# EAGLE design BeamMini (EAGLE 7.5.0)
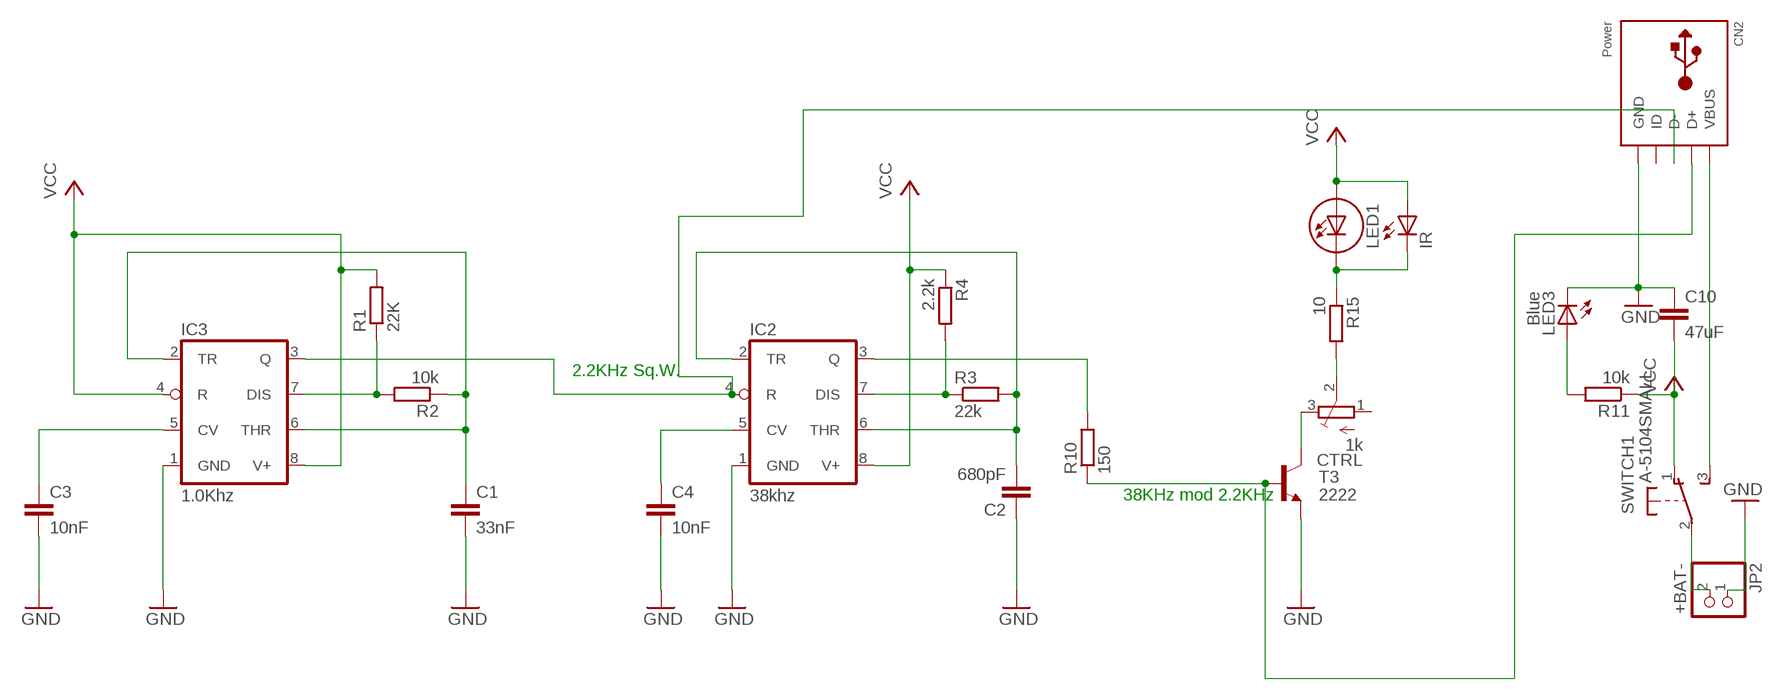
[diagram p0: schematic, sheet 1]

## Parts
C1  33nF  C-EUC0805  [C0805]
C2  680pF  C-EUC0805  [C0805]
C3  10nF  C-EUC0805  [C0805]
C4  10nF  C-EUC0805  [C0805]
C10  47uF  C-EUC0805  [C0805]
CN2  Power  USBMINIB  [USB-MINIB]
CTRL  1k  TRIMPOTTC33X  [TC33X]
IC2  38khz  NE555D  [SO08]
IC3  1.0Khz  NE555D  [SO08]
IR  LED5MM  [LED5MM]
JP2  +BAT-  PINHD-1X02_2.00  [1X02M]
LED1  LUXEON-2  [LUXEON-2]
LED3  Blue  LEDCHIP-LED0805  [CHIP-LED0805]
R1  22K  R-EU_M0805  [M0805]
R2  10k  R-EU_M0805  [M0805]
R3  22k  R-EU_M0805  [M0805]
R4  2.2k  R-EU_M0805  [M0805]
R10  150  R-EU_M0805  [M0805]
R11  10k  R-EU_M0805  [M0805]
R15  10  R-EU_R0805  [R0805]
SWITCH  A-5104SMALL  [A-5104-SMALL]
T3  2222  TRANSISTOR_NPNSOT23  [SOT23]

## Nets
CTRL: CTRL.2(S) R15.2
GND: C1.2 C2.1 C3.2 C4.2 C10.1 CN2.GND IC2.1(GND) IC3.1(GND) JP2.1 LED3.C T3.2(E)
N$1: IC3.7(DIS) R1.1 R2.2
N$2: C3.1 IC3.5(CV)
N$3: C2.2 IC2.2(TR) IC2.6(THR) R3.2
N$4: IC2.7(DIS) R3.1 R4.2
N$5: CN2.D- IC2.4(R) IC3.3(Q)
N$6: C4.1 IC2.5(CV)
N$7: IC2.3(Q) R10.2
N$8: JP2.2 SWITCH.2(1:P)
N$9: C1.1 IC3.2(TR) IC3.6(THR) R2.1
N$10: CN2.D+ R10.1 T3.1(B)
N$11: IR.K(C) LED1.C R15.1
N$12: CTRL.3(E) T3.3(C)
N$16: LED3.A R11.2
N$18: CN2.VBUS SWITCH.3(1:S)
VCC: C10.2 IC2.8(V+) IC3.4(R) IC3.8(V+) IR.A LED1.A R1.2 R4.1 R11.1 SWITCH.1(1:O)
Unconnected: CN2.ID CTRL.1(A) SWITCH.MT1(MT) SWITCH.MT2(MT)

## Notes on the sheet
- 2.2KHz Sq.W.
- 38KHz mod 2.2KHz

## Library data of the parts
C1-C4 C10 = rcl:C-EU: CAPACITOR, European symbol
CN2 = adafruit:USB: USB Connectors USBMINIB - Surface Mount Female Mini-B USB Connector 4UConnector: 06564 By microbuilder.eu Thru-hole RA Female Mini-B USB Connector 4UConnector: 18732 By ladyada.net
CTRL = MyLib:TRIMPOT: SMT trimmer potentiometer part number TC33X http://www.ladyada.net/library/eagle
IC2 IC3 = adafruit:*555: TIMER Changed DIP package to have round (not oval) pin pads http://www.ladyada.net/library/pcb/eaglelibrary.html
IR LED3 = adafruit:LED: LED OSRAM: - CHIPLED LG R971, LG N971, LY N971, LG Q971, LY Q971, LO R971, LY R971 LH N974, LH R974 LS Q976, LO Q976, LY Q976 LO Q996 - Hyper CHIPLED LW Q18S LB Q993, LB Q99A, LB R99A - SideLED LS A670, LO A670, LY A670, LG A670, LP A670 LB A673, LV A673, LT A673, LW A673 LH A674 LY A675 LS A676, LA A676, LO A676, LY A676, LW A676 LS A679, LY A679, LG A679 - Hyper Micro SIDELED® LS Y876, LA Y876, LO Y876, LY Y876 LT Y87S - SmartLED LW L88C, LW L88S LB L89C, LB L89S, LG L890 LS L89K, LO L89K, LY L89K LS L896, LA L896, LO L896, LY L896 - TOPLED LS T670, LO T670, LY T670, LG T670, LP T670 LSG T670, LSP T670, LSY T670, LOP T670, LYG T670 LG T671, LOG T671, LSG T671 LB T673, LV T673, LT T673, LW T673 LH T674 LS T676, LA T676, LO T676, LY T676, LB T676, LH T676, LSB T676, LW T676 LB T67C, LV T67C, LT T67C, LS T67K, LO T67K, LY T67K, LW E67C LS E67B, LA E67B, LO E67B, LY E67B, LB E67C, LV E67C, LT E67C LW T67C LS T679, LY T679, LG T679 LS T770, LO T770, LY T770, LG T770, LP T770 LB T773, LV T773, LT T773, LW T773 LH T774 LS E675, LA E675, LY E675, LS T675 LS T776, LA T776, LO T776, LY T776, LB T776 LHGB T686 LT T68C, LB T68C - Hyper Mini TOPLED® LB M676 - Mini TOPLED Santana® LG M470 LS M47K, LO M47K, LY M47K Source: http://www.osram.convergy.de/
JP2 = pinhead-2:PINHD-1X02: PIN HEADER
LED1 = MyLib:LUXEON-2
R1-R4 R10 R11 R15 = rcl:R-EU_: RESISTOR, European symbol
SWITCH = MyLib:A-5104: E-Switch right-angle slide SPDT Ebay and taydaElectronics A-5014
T3 = SparkFun:TRANSISTOR_NPN: Transistor NPN BJT configuration in SOT23 package. MMBT2222 is the common NPN we use. Double check BCE configuration again layout.

## Net classes
0 default: width 0.203 mm
1 supply: width 0.254 mm

## Board
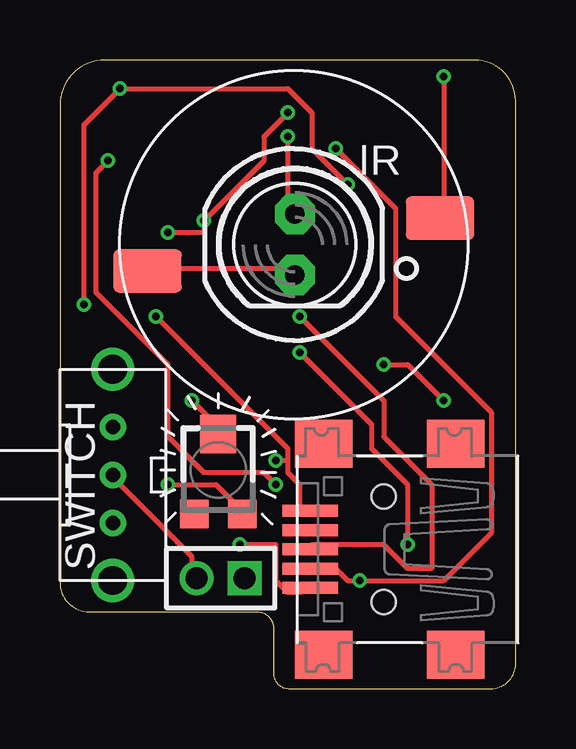
[diagram p1: board, top side]
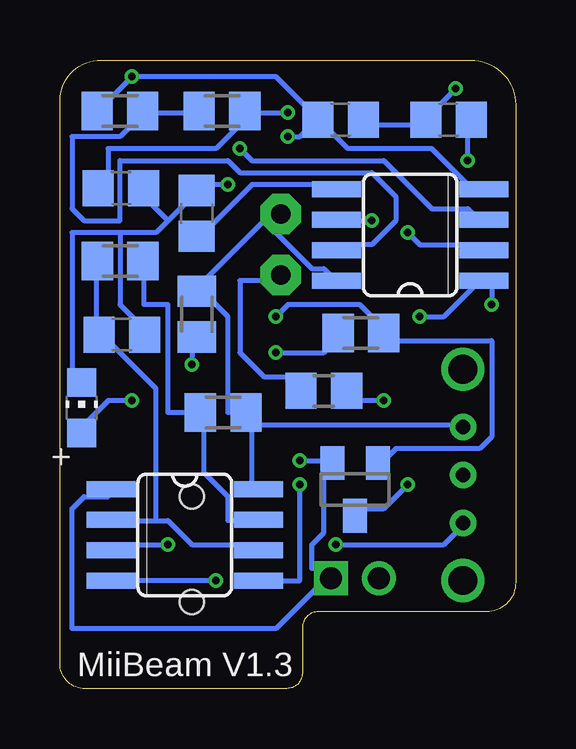
[diagram p2: board, bottom side, seen from below]

Size 19 x 26.19 mm. Coordinates in mm from the lower left corner, seen from the top.
Outline: 19,1.14 19,24.49 arc90 17.3,26.19 1.88,26.19 arc90 0,24.32 0,4.42 arc90 1.22,3.2 8.23,3.2 arc-90 8.9,2.53 8.9,0.64 arc90 9.54,0 18.06,0 arc90 19,1.14
Copper layers (1*16): Top 0.035mm / dielectric 1.5mm / Bottom 0.035mm
Design rules "ITEADstudio_DRC": minimum track width 6mil, minimum drill 12mil, track to track 6mil, track to pad 6mil, pad to pad 6mil, via to via 6mil, smd to smd 0mil, copper to edge 10mil, drill to drill 10mil, minimum pad ring 10mil, minimum via ring 6mil, stop-mask expansion 2mil, vias tented up to drill 100mil, thermal gap 10mil

### Footprints (pad centres in the part's own frame; a part is rotated, then mirrored left to right if it is on the bottom)
C0805 = smd 1.3 x 1.5: 1 -0.95,0; 2 0.95,0
USB-MINIB = smd 0.5 x 2.308: D+ 0,4.064; D- -0.8,4.064; GND 1.6,4.064; ID 0.8,4.064; VBUS -1.6,4.064 | smd 2 x 2.4: GND1 -4.4,-2; GND2 -4.4,3.5; GND3 4.4,3.5; GND4 4.4,-2 | hole 1: -2.2,1; 2.2,1
TC33X = smd 1.2 x 1.2: 1 -1,-1.825; 3 1,-1.825 | smd 1.5 x 1.6: 2 0,1.5
SO08 = smd 0.66 x 2.032: 1 -1.905,-3.073; 2 -0.635,-3.073; 3 0.635,-3.073; 4 1.905,-3.073; 5 1.905,3.073; 6 0.635,3.073; 7 -0.635,3.073; 8 -1.905,3.073
LED5MM = drill 0.813 pad 1.676 octagon: A -1.27,0; K 1.27,0
1X02M = drill 0.914 square: 1 -1,0 | drill 0.914: 2 1,0
LUXEON-2 = smd 2.85 x 1.8: A -6.1,-1.1; C 6.1,1.1
CHIP-LED0805 = smd 1.2 x 1.2: A 0,-1.05; C 0,1.05
M0805 = smd 1.3 x 1.6: 1 -0.95,0; 2 0.95,0
R0805 = smd 1.3 x 1.5: 1 -0.95,0; 2 0.95,0
A-5104-SMALL = drill 0.6: 1 -2,0; 2 0,0; 3 2,0 | drill 1.2: MT1 -4.4,0; MT2 4.4,0
SOT23 = smd 1 x 1.4: 1 -0.95,-1.1; 2 0.95,-1.1; 3 0,1.1

### Placement (x,y rotation side)
C1  16.46,20.85 0 bottom
C2  16.42,14.75 180 bottom
C3  13.3,19.8 90 bottom
C4  2.8,23.7 180 bottom
C10  7.3,23.7 180 bottom
CN2  14.5,5.8 90 top
CTRL  6.6,9.1 0 top
IC2  13.8,6.4 270 bottom
IC3  4.4,18.9 90 bottom
IR  9.8,18.5 270 top
JP2  6.7,4.6 180 top
LED1  9.75,18.5 180 top
LED3  18.1,11.7 0 bottom
R1  16.5,24.07 180 bottom
R2  12.25,24.07 180 bottom
R3  16.5,17.82 180 bottom
R4  12.2,11.5 180 bottom
R10  6.45,14.82 180 bottom
R11  13.3,15.6 270 bottom
R15  8,12.4 0 bottom
SWITCH  2.2,8.9 270 top
T3  6.7,8.3 180 bottom

### Tracks (layer width: path | path; a pad name or v marks a point on that pad's centre or on a via)
CTRL  (via drill 0.3)
  Top 0.203: v5.5,12 6.5,11 CTRL.2
  Bottom 0.203: v5.5,12 7,12 R15.2
GND  (via drill 0.3)
  Top 0.203: v4,15.5 9.5,10 9.5,9.5 | 9.5,9.5 9.5,9 10,8.5 10,7.5 CN2.GND | v1,16 1,23.5 v2.5,25 9.5,25 10.5,24 10.5,22.5 v12,21 | 9.5,9.5 v9,9.5
  Bottom 0.203: IC2.1 17,8 18,8 18.5,7.5 18.5,2.5 10,2.5 8,4.5 JP2.1 8,5 8.5,5 8.5,6 8,6.5 8,9 T3.2 8,9.5 v9,9.5 | 16.5,19 15,19 14.5,19.5 | 16.5,19 18.5,19 18.5,13 LED3.C | 14.5,19.5 13.5,20.5 C3.2 13,21 v12,21 | 16.5,19 16.5,16 15.5,15 C2.1 | 14.5,19.5 15.5,20.5 C1.2 | C10.1 6,23.5 4,23.5 C4.2 3.5,24 v2.5,25 | v4,15.5 3,15.5 1.5,17 IC3.1 1,17 v1,16
N$1
  Bottom 0.203: 15.5,24 13.5,24 R2.2 | 15.5,24 16.5,23 18.5,23 18.5,20 18,19.5 16.5,19.5 16.5,22 12,22 11.5,21.5 6,21.5 5,20.5 5,19.5 6,18.5 7,18.5 IC3.7 | 15.5,24 R1.1
N$2
  Bottom 0.203: C3.1 13,19 11,21 7.5,21 IC3.5
N$3
  Bottom 0.203: R3.2 17.5,17.5 17.5,15 C2.2 17,14.5 15,12.5 15,7 | 15,7 16.5,7 IC2.2 | 15,7 14.5,7 13.5,6 11,6 IC2.6
N$4
  Bottom 0.203: IC2.7 11,7 12,7 12,8 13,9 13,11.5 R4.2 14.5,11.5 14.5,16 15.5,16 15.5,17.5 R3.1
N$5  (via drill 0.3)
  Top 0.203: CN2.D- 11.5,5 12,4.5 v12.5,4.5 16,4.5 18,6.5 18,11.5 14,15.5 14,20 v11.5,22.5
  Bottom 0.203: v12.5,4.5 16.5,4.5 IC2.4 | v11.5,22.5 11,22 5.5,22 3.5,20 2,20 1.5,19.5 IC3.3
N$6  (via drill 0.3)
  Top 0.203: v2,22 1.5,21.5 1.5,16.5 4.5,13.5 4.5,10.5 6,9 8.5,9 v9,8.5
  Bottom 0.203: v2,22 2,23.5 C4.1 | v9,8.5 9,4.5 10.5,4.5 IC2.5
N$7  (via drill 0.3)
  Top 0.203: v10,14 13,11 13,10 14.5,8.5 v14.5,6
  Bottom 0.203: v10,14 8,14 7.5,14.5 R10.2 | v14.5,6 16.5,6 IC2.3
N$8
  Top 0.203: SWITCH.2 2.5,8.5 5.5,5.5 5.5,5 JP2.2
N$9  (via drill 0.3)
  Top 0.203: v4.5,19 6,19 v6,19.5 8.5,22 8.5,23 v9.5,24
  Bottom 0.203: v4.5,19 4,18.5 1.5,18.5 IC3.2 | v6,19.5 7,19.5 IC3.6 | 11,24 12.5,22.5 17,22.5 17,21 C1.1 | 11,24 v9.5,24 | 11,24 R2.1
N$10  (via drill 0.3)
  Top 0.203: v10,15.5 13.5,12 13.5,10.5 15.5,8.5 15.5,5 14.5,5 13.5,6 10.5,6 CN2.D+
  Bottom 0.203: T3.1 5.5,9.5 5,10 1.5,10 1,10.5 1,14.5 5.5,14.5 R10.1 5.5,15 6.5,16 9.5,16 v10,15.5
N$11
  Top 0.203: LED1.C 4,17.5 9.5,17.5 IR.K
  Bottom 0.203: R15.1 9,12.5 9.5,13 10.5,13 11.5,14 11.5,17 10,17 IR.K
N$12  (via drill 0.3)
  Top 0.203: v4.5,8.5 6.5,8.5 7.5,7.5 CTRL.3
  Bottom 0.203: v4.5,8.5 5.5,7.5 6.5,7.5 T3.3
N$16  (via drill 0.3)
  Top 0.203: v16,12 14.5,13.5 v13.5,13.5
  Bottom 0.203: v16,12 17,12 18,11 LED3.A | v13.5,13.5 13.5,14.5 R11.2
N$18  (via drill 0.3)
  Top 0.203: v7.5,6 9,6 9,4.5 9.5,4 10,4 CN2.VBUS
  Bottom 0.203: v7.5,6 3,6 2.5,6.5 SWITCH.3
VCC  (via drill 0.3)
  Top 0.203: v16,25.5 16,20 LED1.A | v9.5,23 9.5,20 IR.A
  Bottom 0.203: C10.2 8,23.5 7,22.5 3.5,22.5 2,21 1.5,21 IC3.4 | R1.2 17,24.5 v16,25.5 10,25.5 8.5,24 C10.2 | 10.5,19.5 13,17 R11.1 13,16.5 12,15.5 12,11.5 R4.1 | 10.5,19.5 10,19.5 IR.A 10.5,19.5 | 10.5,19.5 8.5,17.5 8,17.5 7.5,17 IC3.8 | 11,11 11,8.5 IC2.8 | 11,11 11,11.5 R4.1 | 11,11 2.5,11 SWITCH.1 | 11,11 R4.1 | v9.5,23 9,23 8.5,23.5 C10.2

### Text on the board
bPlace: MiiBeam V1.3